# EAGLE schematic untitled (EAGLE 9.6.1)
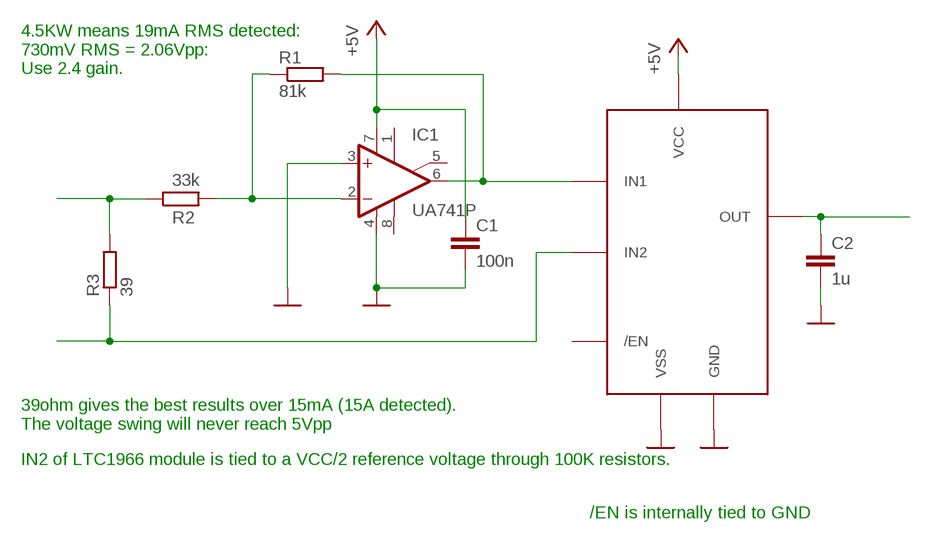
[diagram p0: schematic, sheet 1]

## Parts
C1  100n  C-EU025-025X050  [C025-025X050]
C2  1u  C-EU025-025X050  [C025-025X050]
IC1  UA741P  [DIL08]
R1  81k  R-EU_0207/10  [0207/10]
R2  33k  R-EU_0207/10  [0207/10]
R3  39  R-EU_0207/10  [0207/10]
U$1  LTC1966_MODULE  [LTC1966_MODULE]

## Nets
+5V: C1.1 IC1.7(V+) U$1.P$1(VCC)
GND: C1.2 C2.2 IC1.3(+IN) IC1.4(V-) U$1.P$2(GND) U$1.P$3(VSS)
N$1: IC1.2(-IN) R1.1 R2.2
N$2: IC1.6(OUT) R1.2 U$1.P$4(IN1)
N$3: R3.1 U$1.P$5(IN2)
N$4: R2.1 R3.2
N$5: C2.1 U$1.P$6(OUT)
Unconnected: IC1.1(ON1) IC1.5(ON2) IC1.8(OPT) U$1.P$7(/EN)

## Notes on the sheet
- 4.5KW means 19mA RMS detected: 
  730mV RMS = 2.06Vpp:
  Use 2.4 gain.
- 39ohm gives the best results over 15mA (15A detected). 
  The voltage swing will never reach 5Vpp
- IN2 of LTC1966 module is tied to a VCC/2 reference voltage through 100K resistors.
- /EN is internally tied to GND

## Library data of the parts
C1 C2 = rcl:C-EU: CAPACITOR, European symbol; SPICEPREFIX: C
IC1 = linear:*741: OP AMP; SPICEPREFIX: X
R1-R3 = rcl:R-EU_: RESISTOR, European symbol; SPICEPREFIX: R
U$1 = net_modules:LTC1966_MODULE: LTC1966 Converter module Accurate Micropower Delta Sigma RMS to DC Converter